# EAGLE design OSC555R2 (EAGLE 4.16)
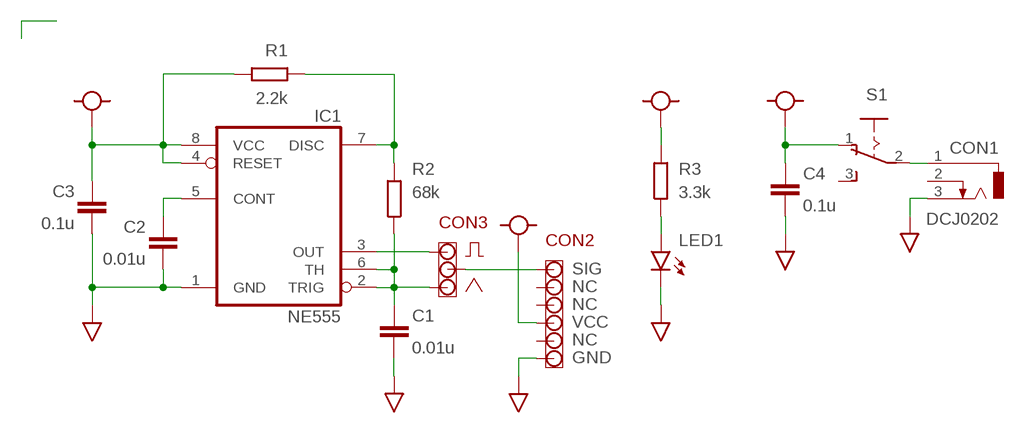
[diagram p0: schematic, sheet 1]

## Parts
C1  0.01u  C-CERAMIC  [C025-025X050]
C2  0.01u  C-CERAMIC  [C025-025X050]
C3  0.1u  C-CERAMIC  [C025-025X050]
C4  0.1u  C-CERAMIC  [C025-025X050]
CON1  DCJ0202  [DCJ0202]
IC1  NE555  [DIL08]
LED1  LED3MM  [LED3MM]
R1  2.2k  R1/8W  [0207/10]
R2  68k  R1/8W  [0207/10]
R3  3.3k  R1/8W  [0207/10]
S1  255SB  [255SB]
U$1  VCC  LAND-NN  [LAND-NN]
U$2  NC  LAND-NN  [LAND-NN]
U$3  NC  LAND-NN  [LAND-NN]
U$4  NC  LAND-NN  [LAND-NN]
U$5  LAND-NN  [LAND-NN]
U$6  SIG  LAND-NN  [LAND-NN]
U$7  LAND-NN  [LAND-NN]
U$8  LAND-NN  [LAND-NN]
U$9  GND  LAND-NN  [LAND-NN]

## Nets
GND: C1.2 C2.2 C3.2 C4.2 CON1.3 IC1.1(GND) LED1.K(C) U$9.P
N$3: U$6.P U$7.P
N$4: LED1.A R3.1
N$5: C2.1 IC1.5(CONT)
N$6: IC1.7(DISC) R1.1 R2.2
N$59: CON1.1 S1.2(P)
SQ: IC1.3(OUT) U$5.P
TRI: C1.1 IC1.2(TRIG) IC1.6(TH) R2.1 U$8.P
VCC: C3.1 C4.1 IC1.4(RESET) IC1.8(VCC) R1.2 R3.2 S1.1(O) U$1.P
Unconnected: CON1.2 S1.3(S) U$2.P U$3.P U$4.P

## Notes on the sheet
- CON3
- CON2

## Library data of the parts
C1-C4 = osc555:C-CERAMIC: Ceramic Conenser
CON1 = osc555:DCJ0202: DC POWER JACK Source: DCJ0202.pdf
IC1 = osc555:NE555
LED1 = osc555:LED3MM: LED
R1-R3 = osc555:R1/8W: Carbon Resistor
S1 = osc555:255SB: SLIDING SWITCH distributor Buerklin, 11G810
U$1-U$9 = osc555:LAND-NN

## Board
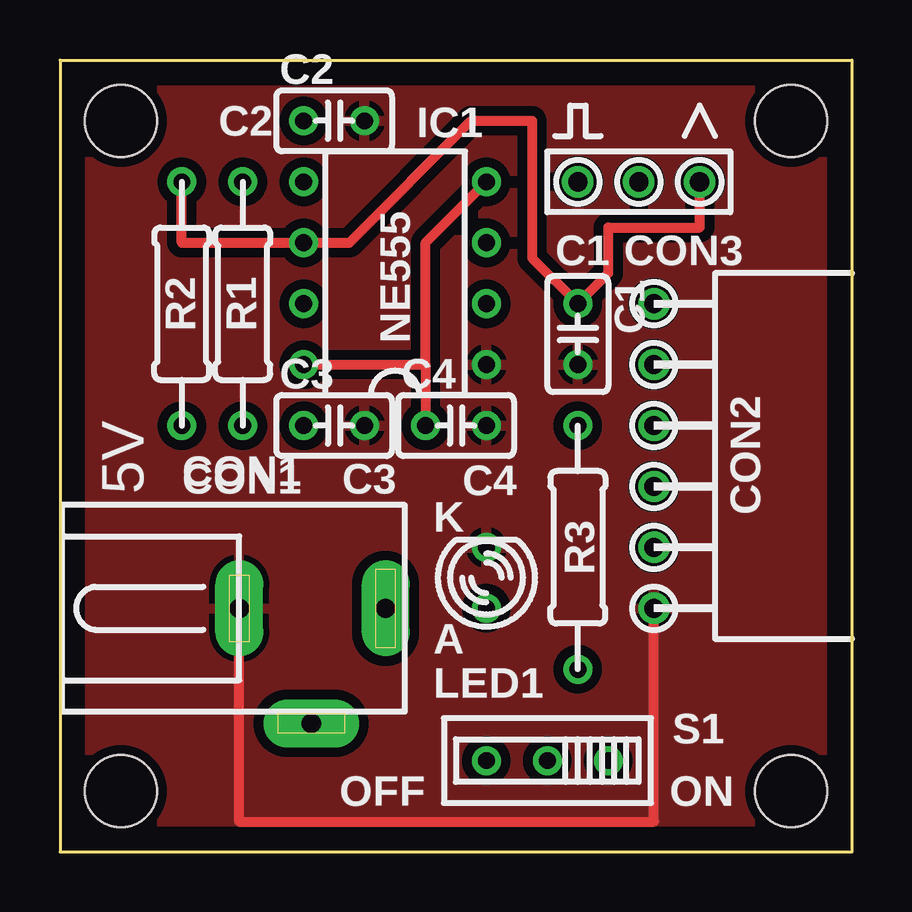
[diagram p1: board, top side]
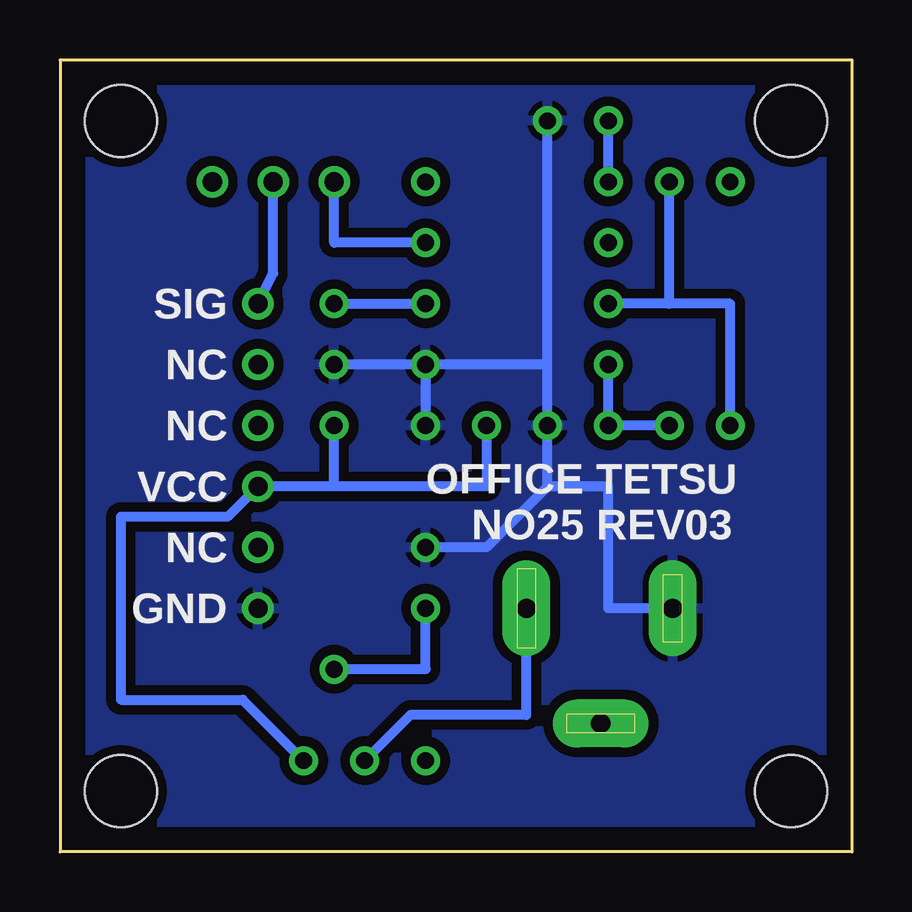
[diagram p2: board, bottom side, seen from below]

Size 33.02 x 33.02 mm. Coordinates in mm from the lower left corner, seen from the top.
Outline: 0,33.02 0,0 33.02,0 33.02,33.02 0,33.02
Copper layers (1*16): Top 0.035mm / dielectric 1.5mm / Bottom 0.035mm
Design rules "OfficeTETSUstandard": minimum track width 6mil, minimum drill 12mil, track to track 6mil, track to pad 6mil, pad to pad 6mil, via to via 6mil, smd to smd 0mil, copper to edge 10mil, drill to drill 10mil, minimum pad ring 10mil, minimum via ring 6mil, stop-mask expansion 2mil, vias tented up to drill 25mil, thermal gap 10mil
Holes 3 mm at 2.54,30.48 2.54,2.54 30.48,2.54 30.48,30.48

### Footprints (pad centres in the part's own frame; a part is rotated, then mirrored left to right if it is on the bottom)
C025-025X050 = drill 0.7 round: 1 -1.27,0; 2 1.27,0
DCJ0202 = drill 0.8 pad 2 long: 1 0,3.1; 2 4.8,0; 3 0,-3
DIL08 = drill 0.7 round: 1 -3.81,-3.81; 2 -1.27,-3.81; 3 1.27,-3.81; 4 3.81,-3.81; 5 3.81,3.81; 6 1.27,3.81; 7 -1.27,3.81; 8 -3.81,3.81
LED3MM = drill 0.7 round: A -1.27,0; K 1.27,0
0207/10 = drill 0.7 round: 1 -5.08,0; 2 5.08,0
255SB = drill 0.7 round: 1 -2.54,0; 2 0,0; 3 2.54,0
LAND-NN = drill 0.8 round: P 0,0

### Placement (x,y rotation side)
C1  21.59,21.59 270 top
C2  11.43,30.48 0 top
C3  11.43,17.78 0 top
C4  16.51,17.78 0 top
CON1  10.48,10.16 270 top
IC1  13.97,24.13 90 top
LED1  17.78,11.43 90 top
R1  7.62,22.86 270 top
R2  5.08,22.86 270 top
R3  21.59,12.7 90 top
S1  20.32,3.81 180 top
U$1  24.77,15.24 180 top
U$2  24.77,12.7 180 top
U$3  24.77,17.78 180 top
U$4  24.77,20.32 180 top
U$5  21.59,27.94 0 top
U$6  24.77,22.86 180 top
U$7  24.13,27.94 0 top
U$8  26.67,27.94 0 top
U$9  24.77,10.16 180 top

### Tracks (layer width: path | path; a pad name or v marks a point on that pad's centre or on a via)
GND
  Top 0.406: U$9.P 24.77,1.27 7.48,1.27 CON1.3
  Bottom 0.406: 12.7,15.24 10.16,15.24 10.16,10.16 CON1.3 | 12.7,20.32 IC1.1 | 12.7,15.24 C3.2 12.7,20.32 | 12.7,20.32 C2.2 | IC1.1 C1.2 | 12.7,15.24 15.24,12.7 LED1.K | IC1.1 C4.2
  pour Top (isolate 0.406): 1.27,31.75 31.75,31.75 31.75,1.27 1.27,1.27
  pour Bottom (isolate 0.406): 1.27,31.75 31.75,31.75 31.75,1.27 1.27,1.27
N$3
  Bottom 0.406: U$7.P 24.13,24.13 U$6.P
N$4
  Bottom 0.406: LED1.A 17.78,7.62 R3.1
N$5
  Bottom 0.406: IC1.5 C2.1
N$6
  Bottom 0.406: 7.62,22.86 IC1.7 | 7.62,22.86 R1.1 | 7.62,22.86 5.08,22.86 R2.2
N$59
  Bottom 0.406: S1.2 18.41,5.71 13.58,5.71 CON1.1
SQ
  Bottom 0.406: IC1.3 21.59,25.4 U$5.P
TRI
  Top 0.406: R2.1 5.08,25.4 IC1.6 12.06,25.4 17.14,30.48 19.68,30.48 19.68,24.77 C1.1 22.86,24.13 22.86,26.04 26.67,26.04 U$8.P
  Bottom 0.406: C1.1 IC1.2
VCC
  Top 0.406: IC1.4 15.24,25.4 15.24,20.32 | IC1.8 15.24,20.32 | 15.24,20.32 C4.1
  Bottom 0.406: S1.1 25.4,6.35 30.48,6.35 30.48,13.97 26.04,13.97 U$1.P 21.59,15.24 | R1.2 C3.1 IC1.8 | 21.59,15.24 15.24,15.24 C4.1 | 21.59,15.24 R3.2

### Text on the board
tPlace: C2 | IC1 | R2 | R1 | C1 | CON3 | CON2 | 5V | CON1 | C3 | C4 | K | R3 | A | LED1 | S1 | OFF | ON
bPlace: OFFICE TETSU | NO25 REV03
tValues: C2